# EAGLE design SoundCircuit (EAGLE 7.3.0)
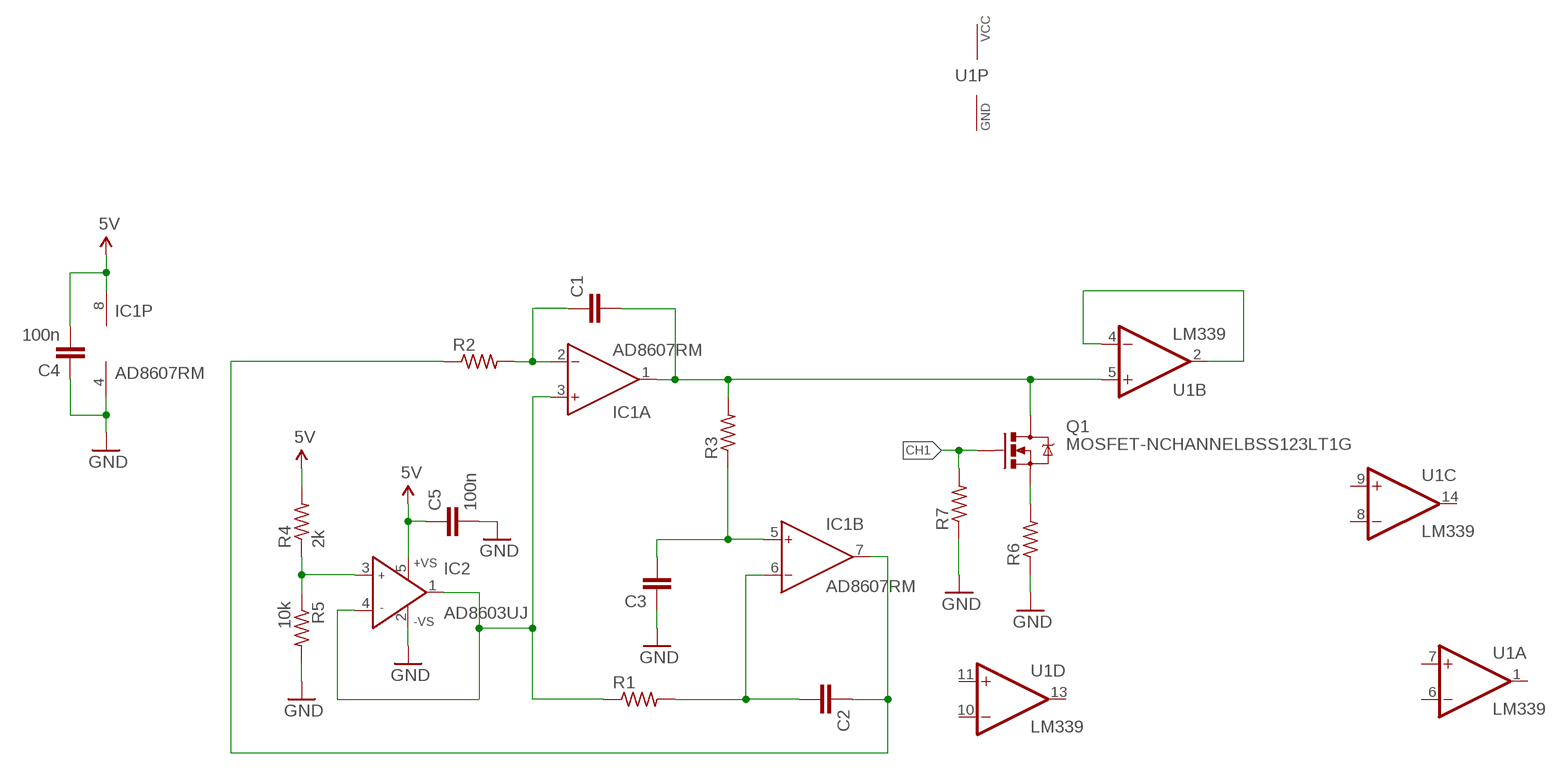
[diagram p0: schematic, sheet 1]

## Parts
C1  C-EUC0402  [C0402]
C2  C-EUC0402  [C0402]
C3  C-EUC0402  [C0402]
C4  100n  C-EUC0402  [C0402]
C5  100n  C-EUC0402  [C0402]
IC1  AD8607RM  [MSOP08]
IC2  AD8603UJ  [SOT23-5]
Q1  MOSFET-NCHANNELBSS123LT1G  [SOT23-3]
R1  R-US_R0402  [R0402]
R2  R-US_R0402  [R0402]
R3  R-US_R0402  [R0402]
R4  2k  R-US_R0402  [R0402]
R5  10k  R-US_R0402  [R0402]
R6  R-US_R0402  [R0402]
R7  R-US_R0402  [R0402]
U1  LM339  [TSSOP-14]

## Nets
5V: C4.2 C5.1 IC1.8(P:V+) IC2.5(+VS) R4.2
CH1: Q1.1(G) R7.2
GND: C3.1 C4.1 C5.2 IC1.4(P:V-) IC2.2(-VS) R5.2 R6.1 R7.1
N$1: C1.2 IC1.1(A:OUT) Q1.3(D) R3.2 U1.5(B:+IN)
N$2: C3.2 IC1.5(B:IN+) R3.1
N$3: C1.1 IC1.2(A:IN-) R2.2
N$4: C2.1 IC1.7(B:OUT) R2.1
N$5: C2.2 IC1.6(B:IN-) R1.2
N$6: IC1.3(A:IN+) IC2.1(OUT) IC2.4(IN-) R1.1
N$7: IC2.3(IN+) R4.1 R5.1
N$8: U1.2(B:OUT) U1.4(B:-IN)
N$9: Q1.2(S) R6.2
Unconnected: U1.1(A:OUT) U1.6(A:-IN) U1.7(A:+IN) U1.8(C:-IN) U1.9(C:+IN) U1.10(D:-IN) U1.11(D:+IN) U1.13(D:OUT) U1.14(C:OUT)

## Power pins joined to a net without a drawn wire
GND: U1.12(P:GND)
VCC: U1.3(P:VCC)

## Library data of the parts
C1-C5 = resistor:C-EU: CAPACITOR, European symbol
IC1 = analog-devices:AD8607: Precision Micropower, Low Noise CMOS, Rail-to-Rail Input/Output Operational Amplifiers Source: http://www.analog.com/static/imported-files/data_sheets/AD8603_8607_8609.pdf; MF: ALTERA CORPORATION; MPN: AD8607ARMZ-REEL; OC_FARNELL: 1464990; OC_NEWARK: 59K6925
IC2 = analog-devices:AD8603: Precision Micropower, Low Noise CMOS, Rail-to-Rail Input/Output Operational Amplifiers Source: http://www.analog.com/static/imported-files/data_sheets/AD8603_8607_8609.pdf; MF: ALTERA CORPORATION; MPN: AD8603AUJZ-REEL7; OC_FARNELL: 1651290; OC_NEWARK: 59K6904
Q1 = SparkFun-DiscreteSemi:MOSFET-NCHANNEL: Common NMOSFET Parts MFG P/N Store ID Prod ID FDD8780 TRANS-09984 SI7820DN TRANS-11055 FDS6630A IC-08089 2N7002PW TRANS-11151 FQP30N06L COM-10213 TRANS-10060 BSS123LT1G TRANS-08345 BSS138 TRANS-00830 BS170 2N7000; PROD_ID: TRANS-08345
R1-R7 = resistor:R-US_: RESISTOR, American symbol
U1 = SparkFun-AnalogIC:LM339: Based on information from the SLCS006N datasheet from TI (www.ti.com). Change Log Date Author Change July 16, 2008 nick@scantool.net Device created.; DESC: IC, Quad Comparator; MANUF: Texas Instruments; PARTNUM: LM339PWR; SUPPLIER: Digikey:296-6607-1-ND; VALSTAT: PARTNUM

## Board
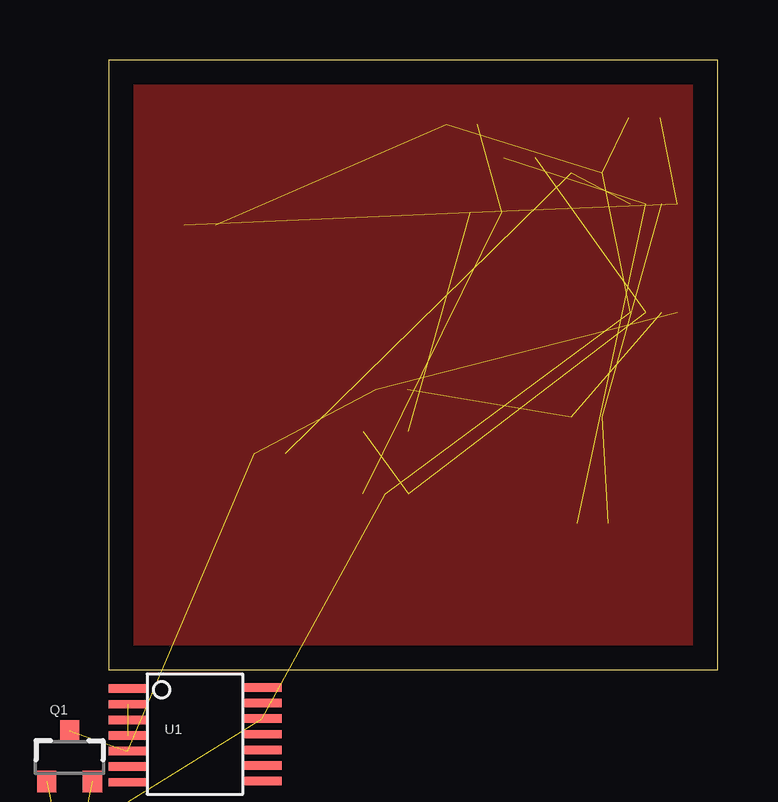
[diagram p1: board, top side]
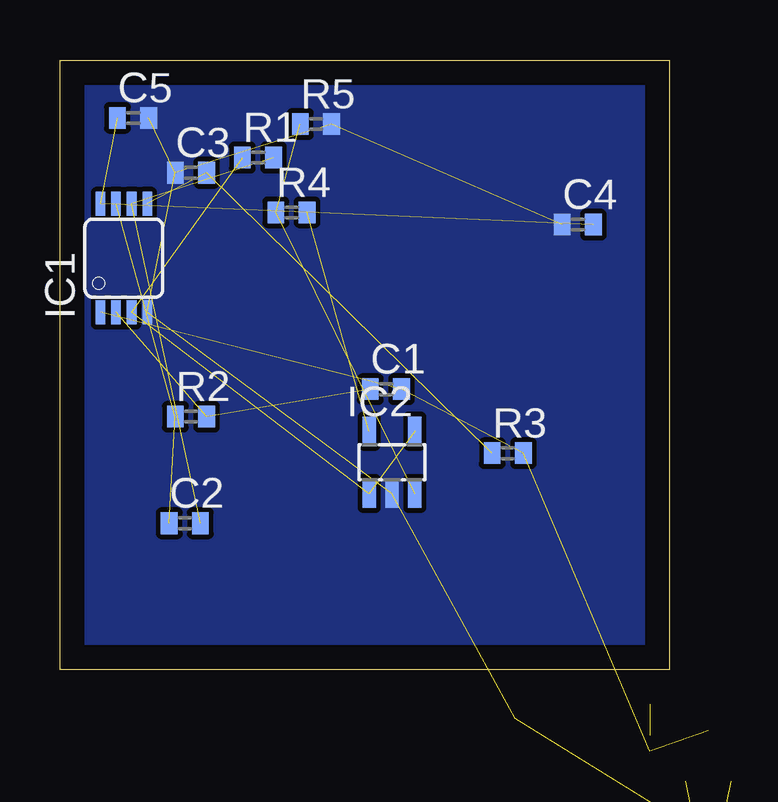
[diagram p2: board, bottom side, seen from below]

Size 25.4 x 25.4 mm. Coordinates in mm from the lower left corner, seen from the top.
Outline: 0,0 25.4,0 25.4,25.4 0,25.4 0,0
Copper layers (1*16): Top 0.035mm / dielectric 1.5mm / Bottom 0.035mm
Design rules "default": minimum track width 10mil, minimum drill 24mil, track to track 8mil, track to pad 8mil, pad to pad 8mil, via to via 8mil, smd to smd 8mil, copper to edge 40mil, drill to drill 8mil, minimum pad ring 10mil, minimum via ring 8mil, stop-mask expansion 4mil, vias tented up to drill 0mil, thermal gap 10mil

### Footprints (pad centres in the part's own frame; a part is rotated, then mirrored left to right if it is on the bottom)
C0402 = smd 0.7 x 0.9: 1 -0.65,0; 2 0.65,0
MSOP08 = smd 0.4 x 1: 1 -0.976,-2.263; 2 -0.326,-2.263; 3 0.324,-2.263; 4 0.974,-2.263; 5 0.974,2.262; 6 0.324,2.262; 7 -0.326,2.262; 8 -0.976,2.262
SOT23-5 = smd 0.55 x 1.2: 1 -0.95,-1.3; 2 0,-1.3; 3 0.95,-1.3; 4 0.95,1.3; 5 -0.95,1.3
SOT23-3 = smd 0.8 x 0.9: 1 -0.95,-1; 2 0.95,-1; 3 0,1.1
R0402 = smd 0.7 x 0.9: 1 -0.65,0; 2 0.65,0
TSSOP-14 = smd 1.6 x 0.35: 1 -2.8,1.9; 2 -2.8,1.25; 3 -2.8,0.6; 4 -2.8,-0.05; 5 -2.8,-0.7; 6 -2.8,-1.35; 7 -2.8,-2; 8 2.8,-1.95; 9 2.8,-1.3; 10 2.8,-0.65; 11 2.8,0; 12 2.8,0.65; 13 2.8,1.3; 14 2.8,1.95

### Placement (x,y rotation side)
C1  11.81,11.68 0 bottom
C2  20.19,6.1 0 bottom
C3  19.94,20.7 0 bottom
C4  3.81,18.54 0 bottom
C5  22.35,22.99 0 bottom
IC1  22.73,17.14 0 bottom
IC2  11.56,8.64 0 bottom
Q1  -1.63,-3.66 0 top
R1  17.14,21.34 0 bottom
R2  19.94,10.54 0 bottom
R3  6.73,9.02 0 bottom
R4  15.75,19.05 0 bottom
R5  14.73,22.73 0 bottom
R6  -1.93,-7.62 0 top  (outside the outline)
R7  -1.93,-10.97 0 top  (outside the outline)
U1  3.61,-2.69 0 top

### Tracks (layer width: path | path; a pad name or v marks a point on that pad's centre or on a via)
5V  (4 unrouted)
CH1  (1 unrouted)
GND  (8 unrouted)
  pour Top (isolate 0.203): 0,25.4 25.4,25.4 25.4,0 0,0
  pour Bottom (isolate 0.203, no thermals): 25.4,25.4 25.4,0 0,0 0,25.4
N$1  (4 unrouted)
N$2  (2 unrouted)
N$3  (2 unrouted)
N$4  (2 unrouted)
N$5  (2 unrouted)
N$6  (3 unrouted)
N$7  (2 unrouted)
N$8  (1 unrouted)
N$9  (1 unrouted)